# Altium schematic sheet LCL_12V_prec.SchDoc
size A3; Organization: Altium Limited; Address1: L3, 12a Rodborough Rd; Address2: Frenchs Forest; Address3: NSW; Address4: Australia 2086
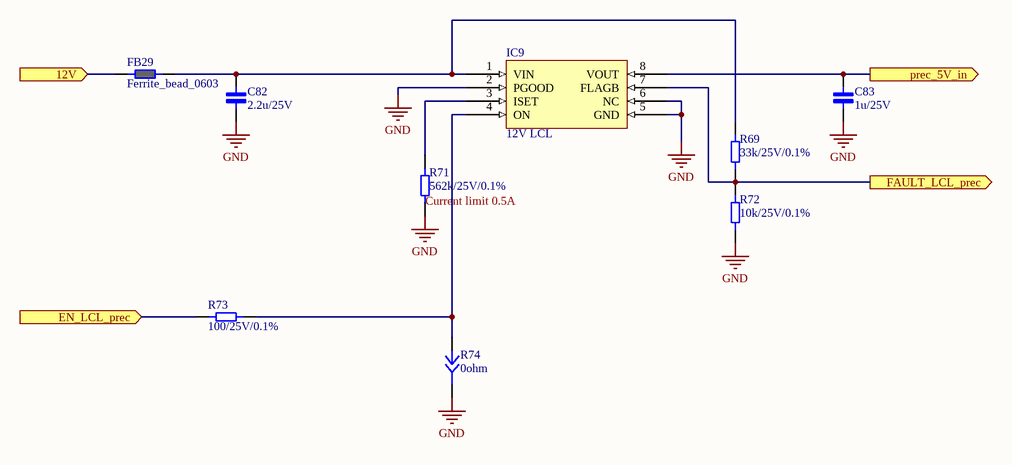
[diagram p0: LCL_12V_prec.SchDoc]

## Parts
C82  2.2u/25V  [CAP_0603]
C83  1u/25V  [CAP_0603]
FB29  Ferrite_bead_0603  [Ferrite_0603]
IC9  12V LCL  [SO8]
R69  33k/25V/0.1%  [RES_0402]
R71  562k/25V/0.1%  [RES_0402]
R72  10k/25V/0.1%  [RES_0402]
R73  100/25V/0.1%  [RES_0402]
R74  0ohm  [Jumper 2]

## Ports
12V (in), EN_LCL_prec (in), FAULT_LCL_prec (out), prec_5V_in (out)

## Nets
GND: C82.1 C83.1 IC9.2(PGOOD) IC9.5(GND) IC9.6(NC) R71.1 R72.1 R74.2
12V: FB29.1 ; port 12V
EN_LCL_prec: R73.1 ; port EN_LCL_prec
FAULT_LCL_prec: IC9.7(FLAGB) R69.1 R72.2 ; port FAULT_LCL_prec
prec_5V_in: C83.2 IC9.8(VOUT) ; port prec_5V_in
NetC82_2: C82.2 FB29.2 IC9.1(VIN) R69.2
NetIC9_3: IC9.3(ISET) R71.2
NetIC9_4: IC9.4(ON) R73.2 R74.2

## Notes on the sheet
- (near R71) Current limit 0.5A
- Title
- Size:
- Date:
- A3
- Number:
- Time:
- Revision:
- Sheet
- of
- File:

## Library data of the parts
C82 = Cap_0603_2.2u_25v: Ceramic Capacitor 2.2uF / 0603 / 25V / ±5%, Wurth Elektronik MLCC
C83 = Cap_0603_1u_25v: Ceramic Capacitor 1uF / 0603 / 25V / ±5%, Wurth Elektronik MLCC
FB29 = Ferrite_bead_0603: Ferrite bead
IC9 = FPF2700: FPF270xMX
R69 = Res_0402_33k: Vishay, thin film resistor 33k/25V/0.1%
R71 = Res_0402_562k: Vishay, thin film resistor 562k/25V/0.1%
R72 = Res_0402_10k: Vishay, thin film resistor 10k/25V/0.1%
R73 = Res_0402_100: Vishay, thin film resistor 100/25V/0.1%
R74 = Jumper